# EasyEDA schematic Schematic.json
TITLE: RPi-SenseStation; REV: 1.2; Date: 2022-10-10; Sheet: 1/1; Company: somni
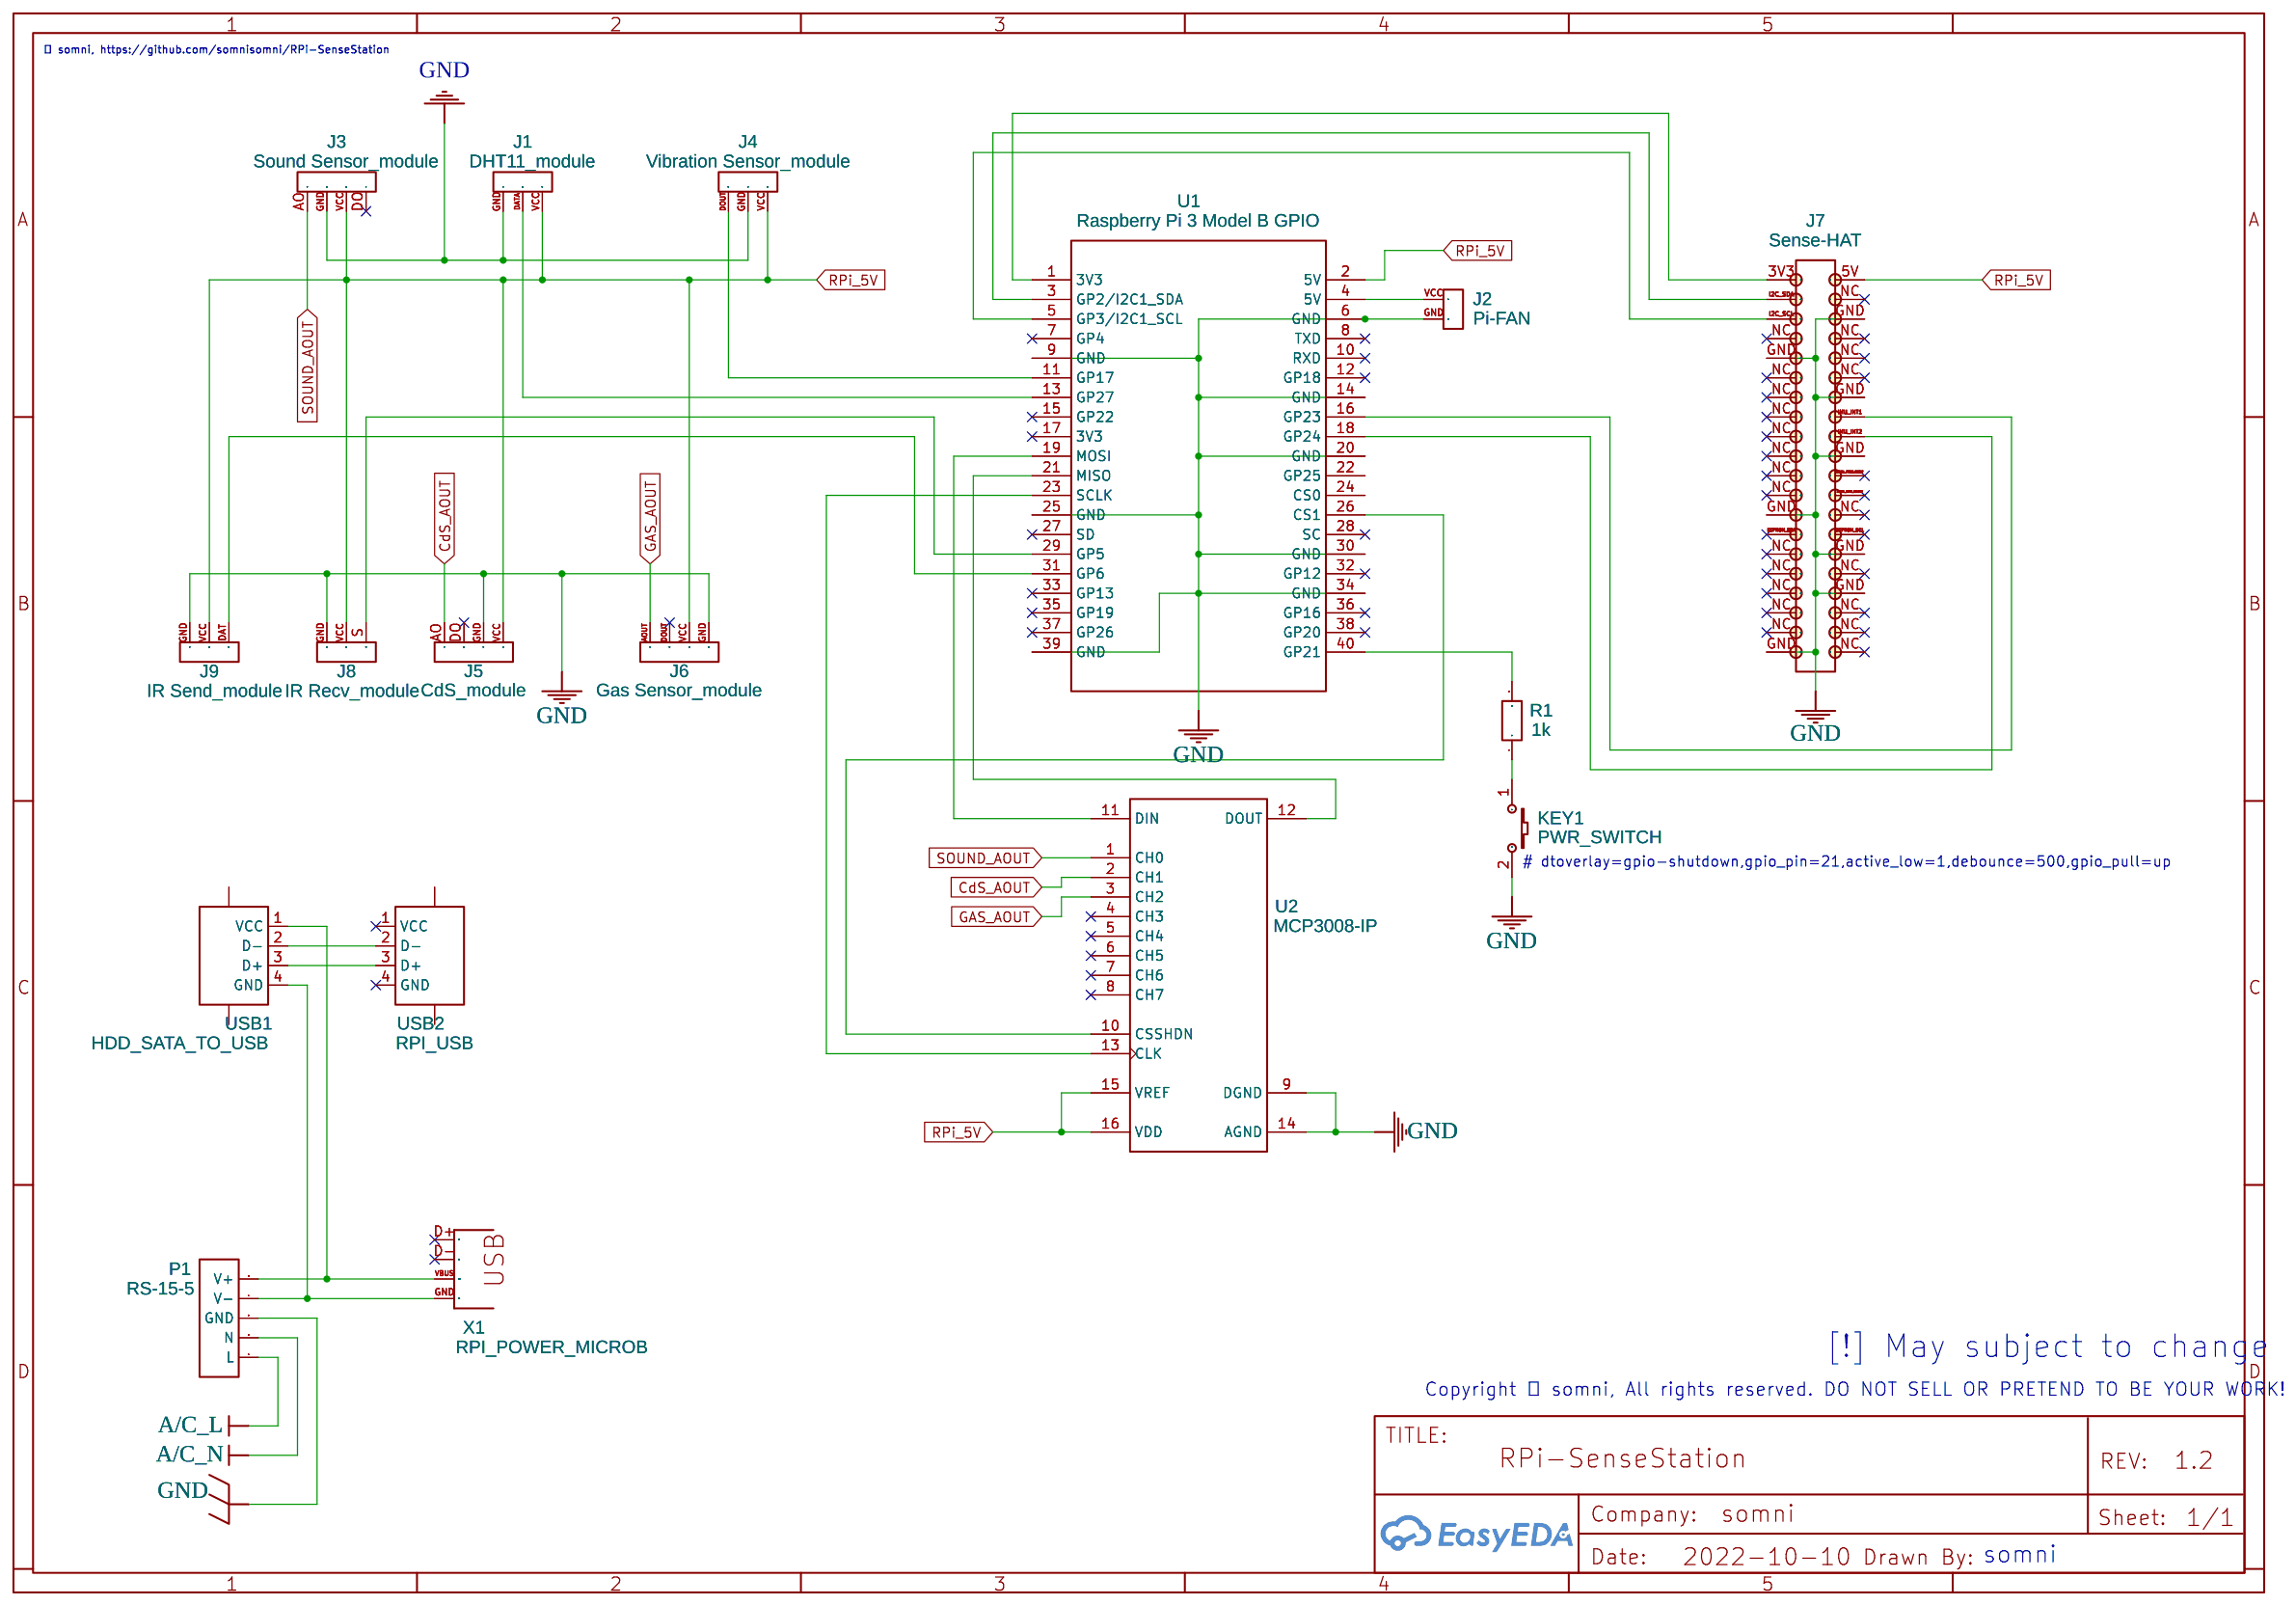
[diagram p0: schematic sheet]

## Parts
J1  DHT11_module
J2  Pi-FAN
J3  Sound Sensor_module
J4  Vibration Sensor_module
J5  CdS_module
J6  Gas Sensor_module
J7  Sense-HAT  [CON--2X20]
J8  IR Recv_module
J9  IR Send_module
KEY1  PWR_SWITCH  [KEY-SMD_2P-L6.2-W3.6-LS8.0]
P1  RS-15-5  [RS-15-5]
R1  1k  [R0603]
U1  Raspberry Pi 3 Model B GPIO  [RASPBERRY PI SHIELD]
U2  MCP3008-IP  [DIP16]
USB1  HDD_SATA_TO_USB  [USB-A-TH_48037-0001]
USB2  RPI_USB  [USB-A-TH_48037-0001]
X1  RPI_POWER_MICROB  [USB-MICROB]

## Library data of the parts
J1 J4 J8 J9 = HEADER_3
J2 = HEADER_2
J3 J5 J6 = HEADER_4
J7 = CON2X20: Contributor: KiCad
KEY1 = K2-3.6×6.1_SMD: Supplier Part: C118141; Supplier: LCSC; Manufacturer Part: K2-1107ST-A4SW-06; Contributor: LCEDA_Lib; 制造商: 韩国韩荣
P1 = RS-15-5: Contributor: Владимир Плеханов; Package Display: No
R1 = R_0603_EU: Contributor: LCEDA_Lib
U1 = Rasbperry Pi (2+) Shield Board fin: sourceId: WJDVrJDVd; Supplier Part: undefined; Supplier: SeeedStudio; link: http://www.seeedstudio.com/depot/Raspberry-Pi-Motor-Board-v10-p-2411.html?cPath=122_154_158; Contributor: Daniela-Marina Draghici
U2 = MCP3008-IP: 2.7V 4-Channel8-Channel 10-Bit AD Converters with SPI Serial Interface, 16-Pin PDIP, Industrial Temperature
USB1 USB2 = USB-Type A_Male: Supplier Part: C112454; Supplier: LCSC; Manufacturer: SOFNG; Manufacturer Part: USB-05; Contributor: LCEDA_Lib
X1 = USB-MICROB: USB Connectors; Contributor: Pinoccio

## Nets
GND: J1.GND(1) J2.GND(2) J3.GND(2) J4.GND(2) J5.GND(2) J6.GND(1) J7.GND(39) J8.GND(1) J9.GND(1) KEY1.2 P1.3(GND) U1.6(GND) U1.9(GND) U1.14(GND) U1.20(GND) U1.25(GND) U1.30(GND) U1.34(GND) U1.39(GND) U2.9(DGND) U2.14(AGND)
A/C_L: P1.1(L)
A/C_N: P1.2(N)
CdS_AOUT: J5.AO(4) U2.2(CH1)
GAS_AOUT: J6.AOUT(4) U2.3(CH2)
RPi_5V: J1.VCC(3) J3.VCC(3) J4.VCC(1) J5.VCC(1) J6.VCC(2) J7.5V(2) J8.VCC(2) J9.VCC(2) U1.2(5V) U2.15(VREF) U2.16(VDD)
SOUND_AOUT: J3.AO(1) U2.1(CH0)
Net-(J1-DATA): J1.DATA(2) U1.13(GP27)
Net-(J2-VCC): J2.VCC(1) U1.4(5V)
Net-(J4-DOUT): J4.DOUT(3) U1.11(GP17)
Net-(J7-3V3): J7.3V3(1) U1.1(3V3)
Net-(J7-I2C_SCL): J7.I2C_SCL(5) U1.5(GP3/I2C1_SCL)
Net-(J7-I2C_SDA): J7.I2C_SDA(3) U1.3(GP2/I2C1_SDA)
Net-(J7-IMU_INT1): J7.IMU_INT1(16) U1.16(GP23)
Net-(J7-IMU_INT2): J7.IMU_INT2(18) U1.18(GP24)
Net-(J8-S): J8.S(3) U1.29(GP5)
Net-(J9-DAT): J9.DAT(3) U1.31(GP6)
Net-(KEY1-1): KEY1.1 R1.1
Net-(P1-4): P1.4(V-) USB1.4(GND) X1.GND
Net-(P1-5): P1.5(V+) USB1.1(VCC) X1.VBUS
Net-(R1-2): R1.2 U1.40(GP21)
Net-(U1-19): U1.19(MOSI) U2.11(DIN)
Net-(U1-21): U1.21(MISO) U2.12(DOUT)
Net-(U1-23): U1.23(SCLK) U2.13(CLK)
Net-(U1-26): U1.26(CS1) U2.10(CSSHDN)
Net-(USB1-2): USB1.2(D-) USB2.2(D-)
Net-(USB1-3): USB1.3(D+) USB2.3(D+)

Not connected (* = marked no-connect by the designer): J3 DO(4)*; J5 DO(3)*; J6 DOUT(3)*; J7 ATMEL_CHIP_SELECT(24)* ATMEL_PROG_RESET(22)* EEPROM_SCL(28)* EEPROM_SDA(27)* NC(29)*; U1 7(GP4)* 8(TXD)* 10(RXD)* 12(GP18)* 15(GP22)* 17(3V3)* 22(GP25) 24(CS0) 27(SD)* 28(SC)* 32(GP12)* 33(GP13)* 35(GP19)* 36(GP16)* 37(GP26)* 38(GP20)*; U2 4(CH3)* 5(CH4)* 6(CH5)* 7(CH6)* 8(CH7)*; USB1 ; USB2  1(VCC)* 4(GND)*; X1 D+* D-*

## Notes on the sheet
- ⓒ somni, https://github.com/somnisomni/RPi-SenseStation
- # dtoverlay=gpio-shutdown,gpio_pin=21,active_low=1,debounce=500,gpio_pull=up
- [!] May subject to change
- Copyright ⓒ somni, All rights reserved. DO NOT SELL OR PRETEND TO BE YOUR WORK!
- somni
